# Altium schematic sheet RotaryDebouncer.SchDoc
size A4; SheetNumber: 2; SheetTotal: 2
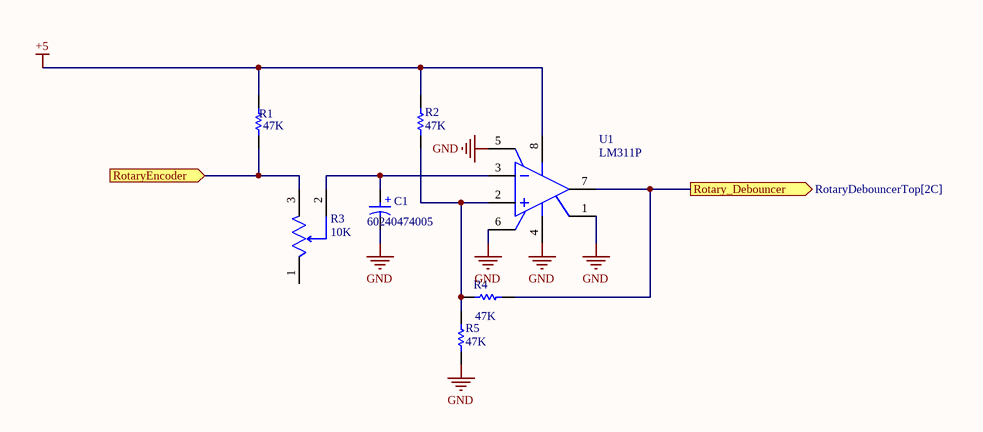
[diagram p0: RotaryDebouncer.SchDoc]

## Parts
C1  60240474005  [WCAP-AT1H_D8H11.5]
R1  47K  [RESA60-630X240]
R2  47K  [RESA60-630X240]
R3  10K  [FP-3296W-MFG]
R4  47K  [RESA60-630X240]
R5  47K  [RESA60-630X240]
U1  LM311P  [FP-P0008A-MFG]

## Ports
Rotary_Debouncer (out, see RotaryDebouncerTop[2C]), RotaryEncoder (in)

## Nets
+5: R1.2 R2.2 U1.8(VCC+)
GND: C1.2(N) R5.1 U1.1(EMIT_OUT) U1.4(VCC-) U1.5(BALANCE) U1.6(BAL/STRB)
Rotary_Debouncer: R4.2 U1.7(COL_OUT) ; port Rotary_Debouncer
RotaryEncoder: R1.1 R3.3(CW) ; port RotaryEncoder
NetC1_1: C1.1(P) R3.2(WIPER) U1.3(IN-)
NetR2_1: R2.1 R4.1 R5.2 U1.2(IN+)

Not connected (* = marked no-connect by the designer): R3 1(CCW)

## Notes on the sheet
- (in symbol CMP-03913-53758680-1) +

## Library data of the parts
C1 = CMP-03913-53758680-1: 860240474005 WCAP-AT1H Aluminum Electrolytic Capacitors; Life (Hours): 8000hours; Ripple Current: 327mA; Voltage Rating: 25V; Capacitance: 100µF; Pitch: 3.5mm; Tolerance: 20%; Leakage Current: 25µA; Height: 11.5mm; Max Operating Temperature: 105°C; Length: 11.5mm; Voltage Rating (DC): 25V; Lead Pitch: 3.5mm; Case/Package: Radial; REACH SVHC: Unknown; Diameter: 8mm; Min Operating Temperature: -40°C; NexarPartId: 53758680; RoHS: Non-Compliant
R1 R2 R4 R5 = CMP-1659-00073-1: Axial Resistor, 100 KOhm, +/- 1%, 0.25 W, -55 to 155 degC, 2-Pin THD, RoHS, Bulk; Voltage Rating: 250 V; Power Rating: 250 mW; Resistance: 475 Ohm; PackageDescription: 2-Pin Axial Lead, Dia 2.4 mm, Body Length 6.3 mm; PackageReference: MFR-25; Length: 0.248 inch; ComponentLink2Description: Datasheet; Packaging: Bulk; DatasheetVersion: Apr-13; Package Quantity: 200; Min Operating Temperature: -55 degC; ComponentLink2URL: http://www.yageo.com/documents/recent/Yageo%20LR_MFR_2013.pdf; RoHSCompliant: true; ComponentLink1URL: http://www.yageo.com/; Tolerance: 1%; Case\Package: Axial; Mount: Through Hole; ComponentLink1Description: Manufacturer URL; Max Operating Temperature: 155 degC
R3 = CMP-2000-05582-2: TRIMMER 2K OHM 0.5W PC PIN TOP; Resistance Tolerance: 10%; Max Power Dissipation: 500mW; Number of Turns: 25; Temperature Coefficient: 100ppm/°C; Resistance: 2kR; Taper: Linear; Width: 9.53mm; Radiation Hardening: No; Length: 9.53mm; Packaging: Rail/Tube; Lead Free: Lead Free; Mount: Panel; Min Operating Temperature: -55°C; Power Rating: 500mW; RoHS Compliant: Yes; REACH SVHC: No SVHC; Color: Blue; Package Quantity: 50; Contact Plating: Tin; Weight: 0.03oz; Technology: CERMET; Max Operating Temperature: 125°C; Tolerance: 10%; Termination: Pin; Resistor Type: Cermet; Military Standard: Not; Height: 0.395inch; Series: 3296; Depth: 4.83mm
U1 = CMP-1685-00016-2: Manufacturer Lifecycle Status: ACTIVE; NexarPartId: 24336; Output Type: TTL; Max Output Voltage: 7.5mV; Min Supply Voltage: 3.5V; Min Dual Supply Voltage: 1.75V; Max Supply Current: 7.5mA; Number of Elements: 1; Response Time: 165ns; Max Dual Supply Voltage: 15V; Max Supply Voltage: 30V; Max Junction Temperature (Tj): 150°C; Max Power Dissipation: 500mW; Input Offset Voltage (Vos): 2mV; Resistance: 390Ω; Operating Supply Voltage: 28V; Power Rating: 100mW; Dual Supply Voltage: 9V; Output Current per Channel: 50mA; Turn-On Delay Time: 115ns; Tolerance: 1%; Voltage Gain: 106.02dB; Input Bias Current: 250nA; Voltage Rating: 75V; Contact Plating: Gold; Case Code (Imperial): 0603; Number of Circuits: 1; Lifecycle Status: Production; Ambient Temperature Range High: 70°C; Radiation Hardening: No; Quiescent Current: 7.5mA; Number of Channels: 1; Max Operating Temperature: 70°C; Height: 5.08mm; Type: General Purpose; Case Code (Metric): 1608; Mount: Surface Mount, Through Hole; Case/Package: PDIP; Thickness: 3.9mm; REACH SVHC: No SVHC; Length: 9.81mm; RoHS: Compliant; Schedule B: 8542390000, 8542390000; Lead Free: Lead Free; Min Operating Temperature: 0°C; Width: 6.35mm; Output Current: 50mA; Packaging: Tape and Reel; Nominal Supply Current: 7.5mA; Weight: 2.012816mg; Propagation Delay: 115ns; Max Input Current: 250nA; Number of Pins: 8